# Altium schematic sheet 最小系统.SchDoc
size A4
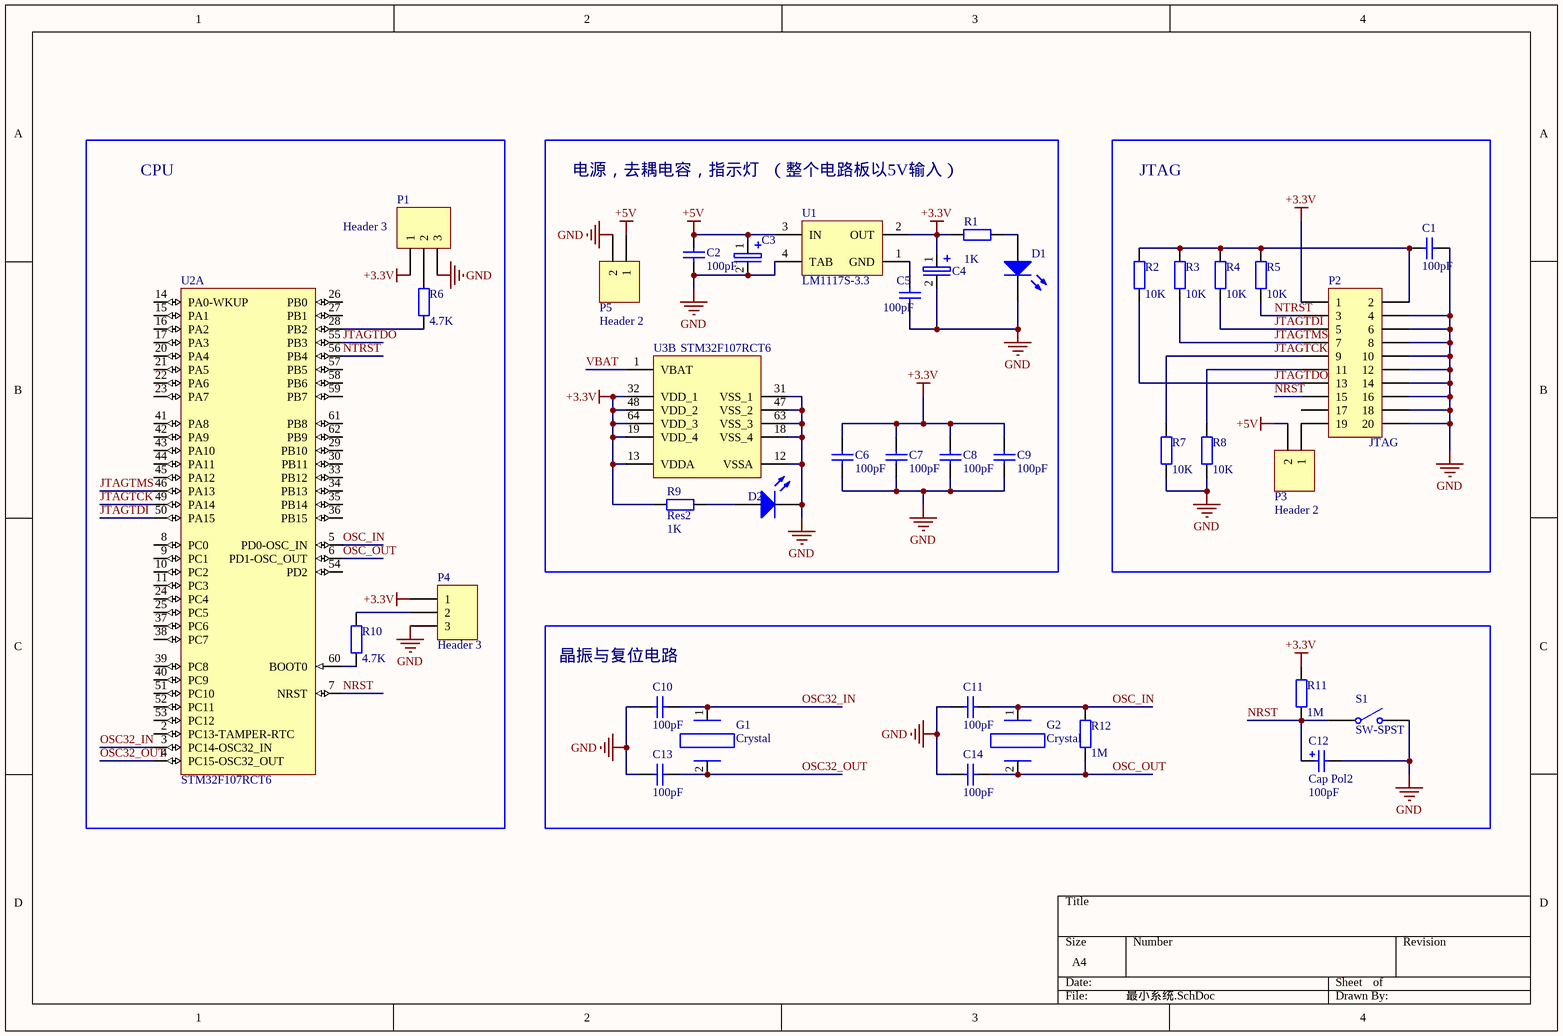
[diagram p0: 最小系统.SchDoc]

## Parts
C1  value 100pF  [0805]  (hidden comment: C0805)
C2  value 100pF  [0805]  (hidden comment: C0805)
C3  Cap_tan  [CAP_tan]  (value not drawn)
C4  Cap_tan  [CAP_tan]  (value not drawn)
C5  value 100pF  [0805]  (hidden comment: C0805)
C6  value 100pF  [0805]  (hidden comment: C0805)
C7  value 100pF  [0805]  (hidden comment: C0805)
C8  value 100pF  [0805]  (hidden comment: C0805)
C9  value 100pF  [0805]  (hidden comment: C0805)
C10  value 100pF  [0805]  (hidden comment: C0805)
C11  value 100pF  [0805]  (hidden comment: C0805)
C12  Cap Pol2  value 100pF  [POLAR0.8]
C13  value 100pF  [0805]  (hidden comment: C0805)
C14  value 100pF  [0805]  (hidden comment: C0805)
D1  LED3  [3.5X2.8X1.9]  (value not drawn)
D2  LED3  [3.5X2.8X1.9]  (value not drawn)
G1  Crystal  [Crystal]
G2  Crystal  [Crystal]
P1  Header 3  [HDR1X3]
P2  JTAG  [HDR2X10]
P3  Header 2  [HDR1X2]
P4  Header 3  [HDR1X3]
P5  Header 2  [HDR1X2]
R1  value 1K  [AXIAL-0.4]  (hidden comment: Res2)
R2  value 10K  [AXIAL-0.4]  (hidden comment: Res2)
R3  value 10K  [AXIAL-0.4]  (hidden comment: Res2)
R4  value 10K  [AXIAL-0.4]  (hidden comment: Res2)
R5  value 10K  [AXIAL-0.4]  (hidden comment: Res2)
R6  value 4.7K  [AXIAL-0.4]  (hidden comment: Res2)
R7  value 10K  [AXIAL-0.4]  (hidden comment: Res2)
R8  value 10K  [AXIAL-0.4]  (hidden comment: Res2)
R9  Res2  value 1K  [AXIAL-0.4]
R10  value 4.7K  [AXIAL-0.4]  (hidden comment: Res2)
R11  value 1M  [AXIAL-0.4]  (hidden comment: Res2)
R12  value 1M  [AXIAL-0.4]  (hidden comment: Res2)
S1  SW-SPST  [SPST-2]
U1  LM1117S-3.3  [TS3B_N]
U2  STM32F107RCT6  [STM-LQFP64_N]  (part A of 2)
U3  STM32F107RCT6  [STM-LQFP64_M]  (part B of 2)

## Blocks framed on the sheet
CPU: P1 P4 R6 R10 U2
电源，去耦电容，指示灯  （整个电路板以5V输入）: C2-C9 D1 D2 P5 R1 R9 U1 U3
JTAG: C1 P2 P3 R2-R5 R7 R8
晶振与复位电路: C10-C14 G1 G2 R11 R12 S1

## Nets
+3.3V: C4.1 C6.1 C7.1 C8.1 C9.1 P1.1 P2.1 P4.1 R1.1 R9.1 R11.2 U1.2(OUT) U3.13(VDDA) U3.19(VDD_4) U3.32(VDD_1) U3.48(VDD_2) U3.64(VDD_3)
+5V: C2.1 C3.1 P3.2 P5.1 U1.3(IN)
GND: C1.2 C2.2 C3.2 C4.2 C5.2 C6.2 C7.2 C8.2 C9.2 C10.1 C11.1 C12.2 C13.1 C14.1 D1.2(K) D2.2(K) P1.3 P2.4 P2.6 P2.8 P2.10 P2.12 P2.14 P2.16 P2.18 P2.20 P4.3 P5.2 R7.1 R8.1 S1.2(NO) U1.4(TAB) U3.12(VSSA) U3.18(VSS_4) U3.31(VSS_1) U3.47(VSS_2) U3.63(VSS_3)
JTAGTCK: P2.9 R7.2 U2.49(PA14)
JTAGTDI: P2.5 R4.1 U2.50(PA15)
JTAGTDO: P2.13 R2.1 U2.55(PB3)
JTAGTMS: P2.7 R3.1 U2.46(PA13)
NRST: C12.1 P2.15 R11.1 S1.1(COMMON) U2.7(NRST)
NTRST: P2.3 R5.1 U2.56(PB4)
OSC32_IN: C10.2 G1.1 U2.3(PC14-OSC32_IN)
OSC32_OUT: C13.2 G1.2 U2.4(PC15-OSC32_OUT)
OSC_IN: C11.2 G2.1 R12.2 U2.5(PD0-OSC_IN)
OSC_OUT: C14.2 G2.2 R12.1 U2.6(PD1-OSC_OUT)
VBAT: U3.1(VBAT)
NetC1_1: C1.1 P2.2 R2.2 R3.2 R4.2 R5.2
NetC5_1: C5.1 U1.1(GND)
NetD1_1: D1.1(A) R1.2
NetD2_1: D2.1(A) R9.2
NetP1_2: P1.2 R6.2
NetP2_11: P2.11 R8.2
NetP2_19: P2.19 P3.1
NetP4_2: P4.2 R10.2
NetR6_1: R6.1 U2.28(PB2)
NetR10_1: R10.1 U2.60(BOOT0)

Not connected (* = marked no-connect by the designer): P2 17; U2 2(PC13-TAMPER-RTC) 8(PC0) 9(PC1) 10(PC2) 11(PC3) 14(PA0-WKUP) 15(PA1) 16(PA2) 17(PA3) 20(PA4) 21(PA5) 22(PA6) 23(PA7) 24(PC4) 25(PC5) 26(PB0) 27(PB1) 29(PB10) 30(PB11) 33(PB12) 34(PB13) 35(PB14) 36(PB15) 37(PC6) 38(PC7) 39(PC8) 40(PC9) 41(PA8) 42(PA9) 43(PA10) 44(PA11) 45(PA12) 51(PC10) 52(PC11) 53(PC12) 54(PD2) 57(PB5) 58(PB6) 59(PB7) 61(PB8) 62(PB9)

## Library data of the parts
C1 C2 C5-C11 C13 C14 = C0805: Ceramic Chip Capacitor - Standard; Note: Footprint corresponds to dimensions for bulk cassette packaging. This case size has tightened tolerances.; Published: 17-Jul-2002; LatestRevisionDate: 19-Mar-2004; LatestRevisionNote: Silkscreen size reduced.; DatasheetDocument: Mar-2001; PackageDocument: Mar-2001; PackageReference: 0805; Publisher: Altium Limited; Code_JEITA: 0805; Code_IPC: 2012[0805]; ComponentLink1Description: Manufacturer Link; ComponentLink1URL: http://www.kemet.com/; ComponentLink2Description: Datasheet; ComponentLink2URL: http://www.kemet.com/kemet/web/homepage/kechome.nsf/vapubfilesname/F3102TA.pdf/$file/F3102TA.pdf
C12 = Cap Pol2: Polarized Capacitor (Axial); Published: 8-Jun-2000; LatestRevisionDate: 17-Jul-2002; LatestRevisionNote: Re-released for DXP Platform.; PackageReference: POLAR0.8; Publisher: Altium Limited; PackageDescription: Polarized Capacitor; 2 Leads
D1 D2 = LED3: Typical BLUE SiC LED; Published: 8-Jun-2000; LatestRevisionDate: 17-Dec-2003; LatestRevisionNote: PCB Footprint replaced.; DatasheetVersion: 16-Apr-2002; PackageVersion: 16-Apr-2002; PackageReference: 3.5X2.8X1.9; Publisher: Altium Limited; PackageDescription: SM LED; 2 C-Bend Leads; Body 3.5 x 2.8 x 1.9 mm, inc leads (LxWxH typ)
P1 P4 = Header 3: Header, 3-Pin; LatestRevisionDate: 17-Jul-2002; LatestRevisionNote: Re-released for DXP Platform.; Publisher: Altium Limited
P2 = Header 10X2: Header, 10-Pin, Dual row; LatestRevisionDate: 17-Jul-2002; LatestRevisionNote: Re-released for DXP Platform.; Publisher: Altium Limited
P3 P5 = Header 2: Header, 2-Pin; LatestRevisionDate: 17-Jul-2002; LatestRevisionNote: Re-released for DXP Platform.; Publisher: Altium Limited
R1-R12 = Res2: Resistor; Published: 8-Jun-2000; LatestRevisionDate: 17-Jul-2002; LatestRevisionNote: Re-released for DXP Platform.; PackageReference: AXIAL-0.4; Publisher: Altium Limited; PackageDescription: Axial Device, Thru-Hole; 2 Leads; 0.4 in Pin Spacing
S1 = SW-SPST: Single-Pole, Single-Throw Switch; Published: 24-Mar-1999; LatestRevisionDate: 17-Jul-2002; LatestRevisionNote: Re-released for DXP Platform.; PackageReference: SPST-2; Publisher: Altium Limited; PackageDescription: Switch; 2 Leads
U1 = LM1117S-3.3: 800mA Low-Dropout Linear Regulator, 3-pin TO-263; Manufacturer: National Semiconductor; PackageTopMarking: NSUZXYTTE#*LM1117S*3.3; CompType: LDO IC; Published: 4-Dec-2008; DatasheetVersion: Apr-2006; PackageVersion: revF, Apr-2005; PackageReference: TS3B; Publisher: Altium Limited; PackageDescription: TO-263, Molded, .400 x .390 x .180in, 3 Lead, .1in Pitch, Surface Mount; Supplier 1: Farnell; Supplier Part Number 1: 1008242; PartNumber: LM1117S-3.3; RoHS: O; PinCount: 3; Code_JEDEC: MO-169-AA; ComponentLink1Description: LM1117 Datasheet; ComponentLink1URL: http://www.national.com/ds/LM/LM1117.pdf; ComponentLink2Description: LM1117 Web Page; ComponentLink2URL: http://www.national.com/pf/LM/LM1117.html; ComponentLink3Description: TS3B Package Page; ComponentLink3URL: http://www.national.com/packaging/folders/ts3b.html
U2 = STM32F107RCT6: ARM Cortex-M3 32-bit MCU, 256 KB Flash, 64 KB Internal RAM, 51 I/Os, 64-pin LQFP, -40 to 85 degC, Tray; A/D Converter: 2x12-bit (16 Channel); D/A Converter: 2x12-bit (2 Channel); FLASH Size (Prog) (kB): 256; I/Os (High Current): 51; Internal RAM Size (kB): 64; Operating Frequency(F) (Processor speed) (MHz): 72; Supply Voltage(Vcc) min (V): 2; DatasheetVersion: Rev. 6; PackageVersion: Rev. 4, 06/2013; PackageReference: LQFP64; PackageDescription: 64-Pin Low Profile Quad Flat Package, 10 x 10 mm Body, 0.5 mm Pitch; Supplier 1: Digi-Key; Supplier Part Number 1: 497-8914-ND; Supplier 2: Farnell; Supplier Part Number 2: 1737139; Supplier 3: Newark; Supplier Part Number 3: 26R3019; Supplier 4: Newark; Supplier Part Number 4: 25R9444; Supplier 5: Mouser; Supplier Part Number 5: 511-STM32F107RCT6; Core: ARM Cortex-M3; Packing: Tray; Mounting Technology: Surface Mount; PartNumber: STM32F107RCT6; ComponentLink1Description: Manufacturer URL; ComponentLink1URL: http://www.st.com/web/en/home.html; ComponentLink2Description: Datasheet; ComponentLink2URL: http://www.st.com/st-web-ui/static/active/en/resource/technical/document/datasheet/CD00220364.pdf; ComponentLink3Description: Package Specification; ComponentLink3URL: http://www.st.com/st-web-ui/static/active/en/resource/technical/document/datasheet/DM00037051.pdf
U3 = CMP-0237-00079-3: ARM Cortex-M3 32-bit MCU, 256 KB Flash, 64 KB Internal RAM, 51 I/Os, 64-pin LQFP, -40 to 85 degC, Tray; FLASH Size (Prog) (kB): 256; Operating Frequency(F) (Processor speed) (MHz): 72; Supply Voltage(Vcc) min (V): 2; Internal RAM Size (kB): 64; A/D Converter: 2x12-bit (16 Channel); I/Os (High Current): 51; D/A Converter: 2x12-bit (2 Channel); Mounting Technology: Surface Mount; PartNumber: STM32F107RCT6; ComponentLink3URL: http://www.st.com/st-web-ui/static/active/en/resource/technical/document/datasheet/DM00037051.pdf; Packing: Tray; ComponentLink1URL: http://www.st.com/web/en/home.html; Core: ARM Cortex-M3; ComponentLink1Description: Manufacturer URL; ComponentLink2URL: http://www.st.com/st-web-ui/static/active/en/resource/technical/document/datasheet/CD00220364.pdf; DatasheetVersion: Rev. 6; PackageDescription: 64-Pin Low Profile Quad Flat Package, 10 x 10 mm Body, 0.5 mm Pitch; PackageVersion: Rev. 4, 06/2013; ComponentLink2Description: Datasheet; ComponentLink3Description: Package Specification; PackageReference: LQFP64